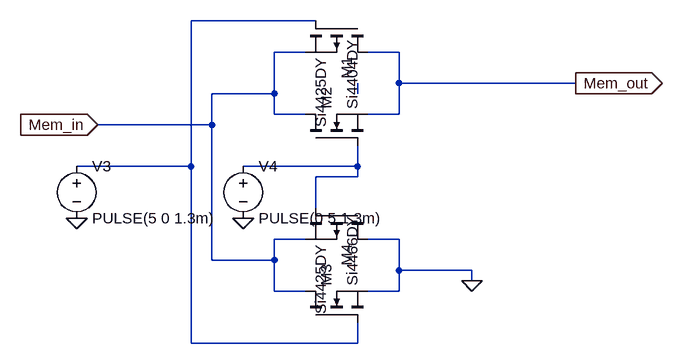
[diagram p0: schematic programmer_with_transmission.asc]
programmer_with_transmission.asc, the LTspice schematic file:
Version 4
SHEET 1 3176 2536
WIRE 1472 1120 1280 1120
WIRE 1456 1168 1408 1168
WIRE 1600 1168 1552 1168
WIRE 1600 1216 1600 1168
WIRE 1872 1216 1600 1216
WIRE 1408 1232 1408 1168
WIRE 1408 1232 1312 1232
WIRE 1536 1232 1536 1216
WIRE 1408 1264 1408 1232
WIRE 1456 1264 1408 1264
WIRE 1600 1264 1600 1216
WIRE 1600 1264 1552 1264
WIRE 1312 1280 1312 1232
WIRE 1312 1280 1136 1280
WIRE 1280 1344 1280 1120
WIRE 1280 1344 1104 1344
WIRE 1536 1344 1536 1312
WIRE 1536 1344 1360 1344
WIRE 1536 1360 1536 1344
WIRE 1536 1360 1472 1360
WIRE 1472 1408 1472 1360
WIRE 1456 1456 1408 1456
WIRE 1600 1456 1552 1456
WIRE 1312 1488 1312 1280
WIRE 1408 1488 1408 1456
WIRE 1408 1488 1312 1488
WIRE 1600 1504 1600 1456
WIRE 1712 1504 1600 1504
WIRE 1712 1520 1712 1504
WIRE 1408 1536 1408 1488
WIRE 1456 1536 1408 1536
WIRE 1600 1536 1600 1504
WIRE 1600 1536 1552 1536
WIRE 1280 1616 1280 1344
WIRE 1536 1616 1536 1584
WIRE 1536 1616 1280 1616
FLAG 1712 1520 0
FLAG 1104 1424 0
FLAG 1360 1424 0
FLAG 1136 1280 Mem_in
IOPIN 1136 1280 In
FLAG 1872 1216 Mem_out
IOPIN 1872 1216 Out
SYMBOL nmos 1456 1312 R270
SYMATTR InstName M2
SYMATTR Value Si4404DY
SYMBOL nmos 1456 1584 R270
SYMATTR InstName M3
SYMATTR Value Si4466DY
SYMBOL voltage 1104 1328 R0
WINDOW 123 0 0 Left 2
WINDOW 39 0 0 Left 2
SYMATTR InstName V3
SYMATTR Value PULSE(5 0 1.3m)
SYMBOL voltage 1360 1328 R0
WINDOW 123 0 0 Left 2
WINDOW 39 0 0 Left 2
SYMATTR InstName V4
SYMATTR Value PULSE(0 5 1.3m)
SYMBOL pmos 1552 1120 R90
SYMATTR InstName M1
SYMATTR Value Si4425DY
SYMBOL pmos 1552 1408 R90
SYMATTR InstName M4
SYMATTR Value Si4425DY

The netlist it stands for:
* programmer_with_transmission.asc
M2 Mem_in N003 Mem_out Mem_out Si4404DY
M3 Mem_in N001 0 0 Si4466DY
V3 N001 0 PULSE(5 0 1.3m)
V4 N003 0 PULSE(0 5 1.3m)
M1 Mem_out N001 Mem_in Mem_in Si4425DY
M4 0 N003 Mem_in Mem_in Si4425DY
.model NMOS NMOS
.model PMOS PMOS
.lib standard.mos
.backanno
.end